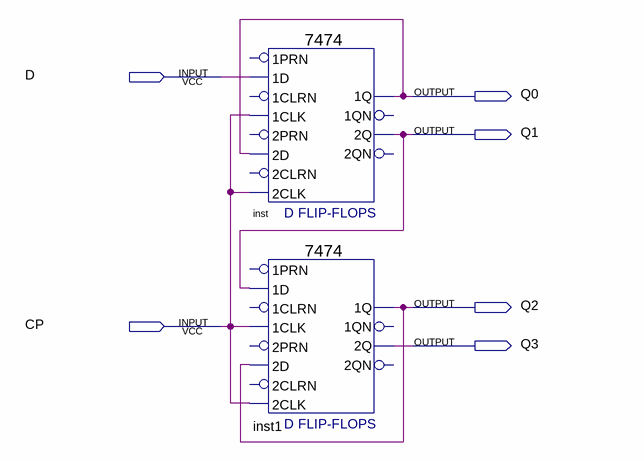
[diagram p0: schematic sheet]
// Quartus schematic Experiment61.bdf as structural Verilog: 2 symbols, 6 pins
module Experiment61 (
  input  D,
  input  CP,
  output Q0,
  output Q1,
  output Q2,
  output Q3
);

  \7474  inst (
    .\2D (Q0), .\1CLK (CP), .\1D (D), .\2CLK (CP), .\2Q (Q1), .\1Q (Q0));  // open: 2PRN, 1PRN, 2CLRN, 1CLRN, 1QN, 2QN
  \7474  inst1 (
    .\2D (Q2), .\1CLK (CP), .\1D (Q1), .\2CLK (CP), .\2Q (Q3), .\1Q (Q2));  // open: 2PRN, 1PRN, 2CLRN, 1CLRN, 1QN, 2QN
endmodule
